# EasyEDA Pro project yuntai参考PCB.epro

# Schematic Schematic1
Assembly Variant: Basic; Board Name: Board1; Create Date: 2026-07-20; Page Name: P1; Project Name: yuntai3.0; Schematic Name: Schematic1; Update Date: 2026-07-20; Company: 嘉立创EDA; Page Size: A4; Version: V1.0
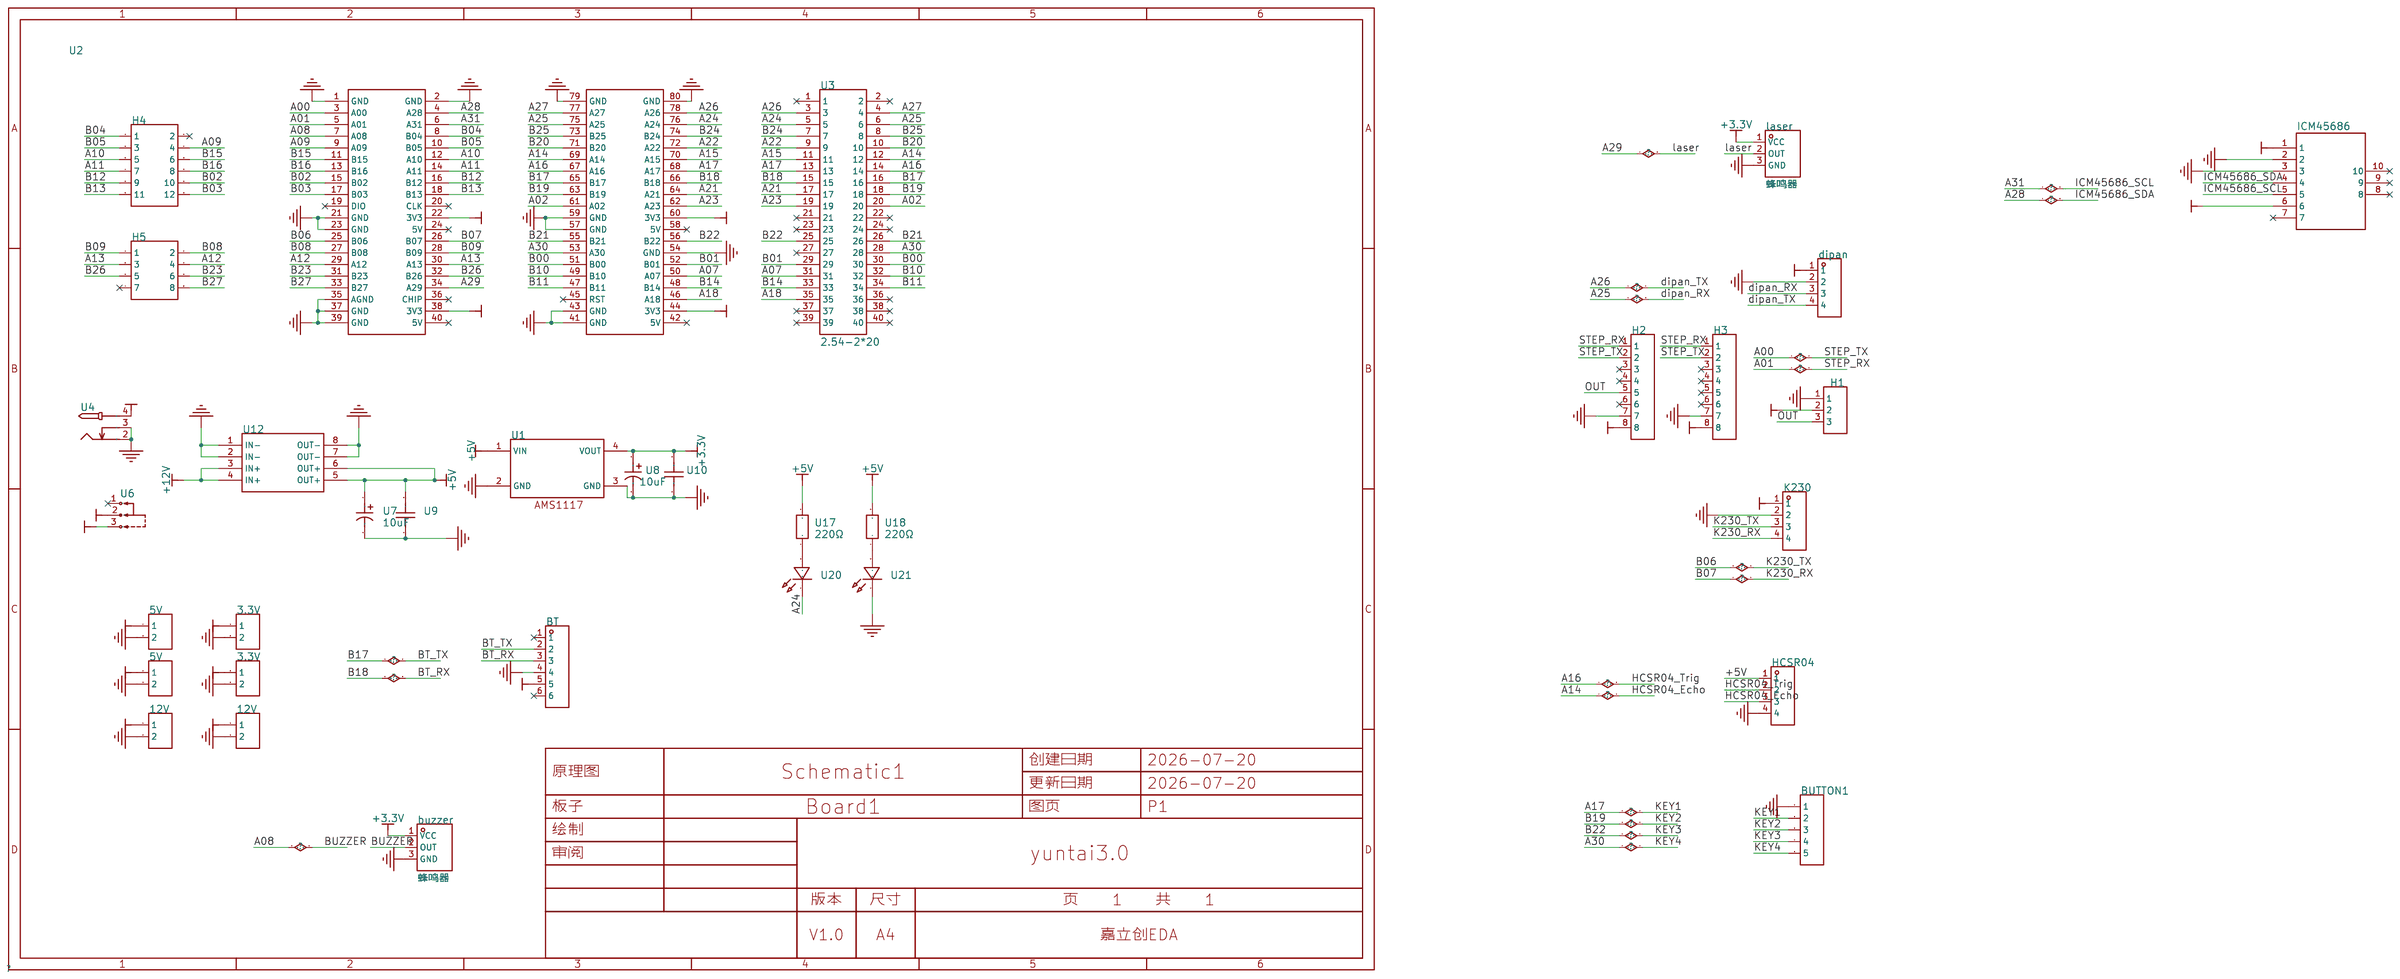
[diagram p0: schematic sheet]

## Parts
3.3V  -  [HDR-TH_2P-P2.54-V-F]
3.3V#2  -  [HDR-TH_2P-P2.54-V-F]
5V  -  [HDR-TH_2P-P2.54-V-F]
5V#2  -  [HDR-TH_2P-P2.54-V-F]
12V  -  [HDR-TH_2P-P2.54-V-F]
12V#2  -  [HDR-TH_2P-P2.54-V-F]
BT  -  [HDR-TH_6P-P2.54-V-F]
BUTTON1  -  [HDR-TH_5P-P2.54-V-F]
buzzer  蜂鸣器  [蜂鸣器]
dipan  -  [HDR-TH_4P-P2.54-V-F]
H1  -  [HDR-TH_3P-P2.54-V-F]
H2  -  [HDR-TH_8P-P2.54-V-F-1]
H3  -  [HDR-TH_8P-P2.54-V-F-1]
H4  -  [HDR-TH_12P-P2.54-V-M-R2-C6-S2.54]
H5  -  [HDR-TH_8P-P2.54-V-F-R2-C4-S2.54-1]
HCSR04  -  [HDR-TH_4P-P2.54-V-F]
ICM45686  -  [ICM45686]
K230  -  [HDR-TH_4P-P2.54-V-F]
laser  蜂鸣器  [蜂鸣器]
U1  -  [AMS1117模块]
U2  LCKFB-TMX-MSPM0G3507  [COMM-TH_LCKFB-TMX-MSPM0G3507]
U3  2.54-2*20  [HDR-TH_40P-P2.54-V-F-R2-C20-S2.54]
U4  DC005-2.5  [DC-IN-TH_DC005-2.5MM]
U6  SS12D10G5  [SW-TH_SHOU-HAN_SS12D10G4]
U7  10uF  [CAP-TH_BD5.0-P2.00-D0.5-FD-1]
U8  10uF  [CAP-TH_BD5.0-P2.00-D0.5-FD-1]
U9  -  [0.1uf陶瓷电容直插]
U10  -  [0.1uf陶瓷电容直插]
U12  -  [MP1584EN降压模块]
U17  220Ω  [RES-TH_BD2.7-L6.2-P10.20-D0.4]
U18  220Ω  [RES-TH_BD2.7-L6.2-P10.20-D0.4]
U20  LTL-307E  [LED-TH_BD3.0-P2.54-FD]
U21  LTL-307E  [LED-TH_BD3.0-P2.54-FD]

## Library data of the parts
3.3V 3.3V#2 5V 5V#2 12V 12V#2 = HDR-F_2.54_1x2P: Supplier Part: C49661; Supplier Footprint: 插件
BT = HDR-F_2.54_1x6P: Supplier Part: C40877; Supplier Footprint: 插件
BUTTON1 = HDR-F_2.54_1x5P: Supplier Part: C50950; Supplier Footprint: 插件
buzzer laser = 蜂鸣器: Supplier Part: C9900010938; Datasheet: https://atta.szlcsc.comnull; Supplier: LCSC
dipan HCSR04 K230 = HDR-F_2.54_1x4P: Supplier Part: C2718488; Supplier Footprint: 插件
H1 = HDR-F_2.54_1x3P: Supplier Part: C541850; Supplier Footprint: 插件
H2 H3 = HDR-F_2.54_1x8P: Supplier Part: C27438; Supplier Footprint: 插件
H4 = HDR-F_2.54_2x6
H5 = HDR-F_2.54_2x4: Supplier Part: C92271; Supplier Footprint: 插件
ICM45686 = ICM45686
U1 = AMS1117模块: _: 3
U2 = LCKFB-TMX-MSPM0G3507: 该开发板板载德州仪器的微控制器核心,完美适配电赛指定TI芯片题目的要求。支持Keil、CCS和IAU等环境开发,搭配图形化代码生成工具,无需在意底层驱动,助力快速开发。硬件上带有多电源保护,防反接/防过流/受电压,和三路参考电压选择,降低电衰试错成本。80P引脚的引出方便扩展,提供完善的入门手册和模块移植案例。; LCSC Part Name: 5件套 立创·天猛星MSPM0G3507开发板; Supplier Part: C42378531; Manufacturer: 立创开发板; JLCPCB Part Class: Extended Part; Datasheet: https://item.szlcsc.com/datasheet/LCKFB-TMX-MSPM0G3507/44281600.html; Supplier: LCSC
U3 = 2.54-2*20: 插孔结构:2x20P;间距:2.54mm;行距:2.54mm;圆孔/方孔:方孔;安装类型:直插;排数:双排;总孔位数:40P;额定电流:2.5A;额定电压:-;插孔方向:顶部;塑高:8.5mm;工作温度范围:-40℃~+105℃;; LCSC Part Name: 间距:2.54mm 2x20P 直插; Supplier Part: C2977589; Manufacturer: ZHOURI(洲日); Supplier Footprint: 插件,P=2.54mm; JLCPCB Part Class: 扩展库; Datasheet: https://atta.szlcsc.com/upload/public/pdf/source/20220328/834E302BE3C038BBC5C70F5E02589B1E.pdf; Supplier: LCSC; Holes Structure: 2x20P; Pitch: 2.54mm; Row Spacing: 2.54mm; Circular Hole / Square Hole: 方孔; Mounting Type: 直插; Number of Rows: 双排; Number of Holes: 40P; Current Rating (Max): 2.5A; Holes Direction: 顶部; Insulation Height: 8.5mm; Operating Temperature Range: -40℃~+105℃
U4 = DC005-2.5: 连接器类型:DC电源插座;安装方式:弯插;触点内径:2.5mm;触点外径:6.3mm;额定电流:500mA;额定电压:30V;工作温度范围:-25℃~+70℃;; LCSC Part Name: DC电源插座 内径:2.5mm 外径:6.3mm; Supplier Part: C7507454; Manufacturer: SHOU HAN(首韩); Supplier Footprint: 插件; JLCPCB Part Class: 扩展库; Datasheet: https://atta.szlcsc.com/upload/public/pdf/source/20231013/7634FFE9E6B635EE77C0C008CDC877DB.pdf; Supplier: LCSC; Connector Type: DC电源插座; Mounting Style: 弯插; Inside Contact Diameter: 2.5mm; Outside Contact Diameter: 6.3mm; Current Rating (Max): 500mA; Voltage Rating (Max): 30V; Operating Temperature Range: -25℃~+70℃
U6 = SS12D10G5: 电路结构:单刀双掷;安装方式:直插;额定电流(DC):2A;额定电压(DC):125V;机械寿命:3千次;; LCSC Part Name: 两档立式插件 3脚拨动开关 柄长5.0mm; Supplier Part: C7431054; Manufacturer: SHOU HAN(首韩); Supplier Footprint: 插件; JLCPCB Part Class: 扩展库; Datasheet: https://atta.szlcsc.com/upload/public/pdf/source/20231130/7A3DB6A149BF0A1DCFFE64FFC07FE434.pdf; Supplier: LCSC; Circuit: 单刀双掷; Switch Length: 12.7mm; Switch Width: 6.7mm; Mounting Style: 直插; Current Rating (DC): 2A; Voltage Rating (DC): 125V; Mechanical Life: 3千次; Operating Temperature: -25℃~+70℃
U7 U8 = CV4R7MG511BP: 容值:4.7uF;精度:±20%;额定电压:50V;纹波电流:58mA@100kHz;等效串联电阻(ESR):2.5Ω@100kHz;; LCSC Part Name: 4.7uF ±20% 50V; Supplier Part: C2844413; Manufacturer: TWBOR(伯鸿); Supplier Footprint: 插件,D5xL11mm; JLCPCB Part Class: 扩展库; Datasheet: https://atta.szlcsc.com/upload/public/pdf/source/20210727/C2844413_0C02A797581ED1BB0754F03B8FF69A80.pdf; Supplier: LCSC; Tolerance: ±20%; Voltage Rating: 50V; Ripple Current: 58mA@100kHz; Equivalent Series Resistance(ESR): 2.5Ω@100kHz; Pin Spacing: 2mm; Diameter: 5mm; Height - Seated (Max): 11mm; Lifetime: 5000hrs@105℃; Operating Temperature: -40℃~+105℃
U9 U10 = 0.1uf陶瓷电容直插
U12 = MP1584EN降压模块: _: 3
U17 U18 = MF1/4W-1K±1%-ST52: 电阻类型:金属膜电阻;阻值:1kΩ;精度:±1%;功率:250mW;温度系数:±100ppm/℃;; LCSC Part Name: 金属膜电阻 1kΩ ±1% 250mW; Supplier Part: C2903245; Manufacturer: VO(翔胜); Supplier Footprint: 插件,D2.7xL6.2mm; JLCPCB Part Class: 扩展库; Datasheet: https://atta.szlcsc.com/upload/public/pdf/source/20200609/C601728_5AA4C0C8E12E11069DA2C3356F29D1F2.pdf; Supplier: LCSC; Type: 金属膜电阻; Tolerance: ±1%; Overload Voltage (Max): 250V; Power(Watts): 250mW; Temperature Coefficient: ±100ppm/℃; Operating Temperature Range: -55℃~+155℃
U20 U21 = LTL-307E: 发光颜色:红色;正向电压(VF):2V;正向电流:20mA;主波长:623nm;透镜颜色:红色透镜;发光强度:19mcd;发光角度:50°;; LCSC Part Name: 直插F5红光LED; Supplier Part: C575489; Manufacturer: LITEON(光宝); Supplier Footprint: 插件; JLCPCB Part Class: 扩展库; Supplier: LCSC; Emitted Color: 红色; Forward Voltage (VF): 2V; Forward Current: 20mA; Dominant Wavelength: 623nm; Peak Wavelength: 635nm; Lens Color: 红色透镜; Luminous Intensity: 19mcd; Viewing Angle: 50°

## Nets
+3.3V: 3.3V.1 3.3V#2.1 buzzer.1(VCC) ICM45686.1 ICM45686.6 laser.1(VCC) U1.4(VOUT) U2.22(3V3) U2.38(3V3) U2.44(3V3) U2.60(3V3) U8.1 U10.2
+5V: 5V.1 5V#2.1 BT.5 dipan.1 H1.2 HCSR04.1 K230.1 U1.1(VIN) U7.1 U9.2 U12.5(OUT+) U12.6(OUT+) U17.2 U18.2
+12V: 12V.1 12V#2.1 H2.8 H3.8 U6.3 U12.3(IN+) U12.4(IN+)
GND: 3.3V.2 3.3V#2.2 5V.2 5V#2.2 12V.2 12V#2.2 BT.4 BUTTON1.1 buzzer.3(GND) dipan.2 H1.1 H2.7 H3.7 HCSR04.4 ICM45686.2 ICM45686.3 K230.2 laser.3(GND) U1.2(GND) U1.3(GND) U2.1(GND) U2.2(GND) U2.21(GND) U2.23(GND) U2.35(AGND) U2.37(GND) U2.39(GND) U2.41(GND) U2.43(GND) U2.54(GND) U2.57(GND) U2.59(GND) U2.79(GND) U2.80(GND) U4.2 U4.3 U7.2 U8.2 U9.1 U10.1 U12.1(IN-) U12.2(IN-) U12.7(OUT-) U12.8(OUT-) U21.1(C)
VCC: U4.4 U6.2
A00: H2.2 H3.2 U2.3(A00)
A01: H2.1 H3.1 U2.5(A01)
A02: U2.61(A02) U3.20
A07: U2.50(A07) U3.31
A08: buzzer.2(OUT) U2.7(A08)
A09: H4.4 U2.9(A09)
A10: H4.5 U2.12(A10)
A11: H4.7 U2.14(A11)
A12: H5.4 U2.29(A12)
A13: H5.3 U2.30(A13)
A14: HCSR04.3 U2.69(A14) U3.12
A15: U2.70(A15) U3.11
A16: HCSR04.2 U2.67(A16) U3.14
A17: BUTTON1.2 U2.68(A17) U3.13
A18: U2.46(A18) U3.35
A21: U2.64(A21) U3.17
A22: U2.72(A22) U3.9
A23: U2.62(A23) U3.19
A24: U2.76(A24) U3.5 U20.1(C)
A25: dipan.3 U2.75(A25) U3.6
A26: dipan.4 U2.78(A26) U3.3
A27: U2.77(A27) U3.4
A28: ICM45686.4 U2.4(A28)
A29: laser.2(OUT) U2.34(A29)
A30: BUTTON1.5 U2.53(A30) U3.28
A31: ICM45686.5 U2.6(A31)
B00: U2.51(B00) U3.30
B01: U2.52(B01) U3.29
B02: H4.10 U2.15(B02)
B03: H4.12 U2.17(B03)
B04: H4.1 U2.8(B04)
B05: H4.3 U2.10(B05)
B06: K230.3 U2.25(B06)
B07: K230.4 U2.26(B07)
B08: H5.2 U2.27(B08)
B09: H5.1 U2.28(B09)
B10: U2.49(B10) U3.32
B11: U2.47(B11) U3.34
B12: H4.9 U2.16(B12)
B13: H4.11 U2.18(B13)
B14: U2.48(B14) U3.33
B15: H4.6 U2.11(B15)
B16: H4.8 U2.13(B16)
B17: BT.2 U2.65(B17) U3.16
B18: BT.3 U2.66(B18) U3.15
B19: BUTTON1.3 U2.63(B19) U3.18
B20: U2.71(B20) U3.10
B21: U2.55(B21) U3.26
B22: BUTTON1.4 U2.56(B22) U3.25
B23: H5.6 U2.31(B23)
B24: U2.74(B24) U3.7
B25: U2.73(B25) U3.8
B26: H5.5 U2.32(B26)
B27: H5.8 U2.33(B27)
OUT: H1.3 H2.5
$1N55: U18.1 U21.2(A)
$1N66: U17.1 U20.2(A)

Not connected (* = marked no-connect by the designer): BT 1* 6*; H2 3* 4* 6*; H3 3* 4* 5* 6*; H4 2*; H5 7*; ICM45686 7* 8* 9* 10*; U2 19(DIO)* 20(CLK)* 24(5V)* 36(CHIP)* 40(5V)* 42(5V)* 45(RST)* 58(5V)*; U3 1* 2* 21* 22* 23* 24* 27* 36* 37* 38* 39* 40*; U6 1*

# Board PCB1
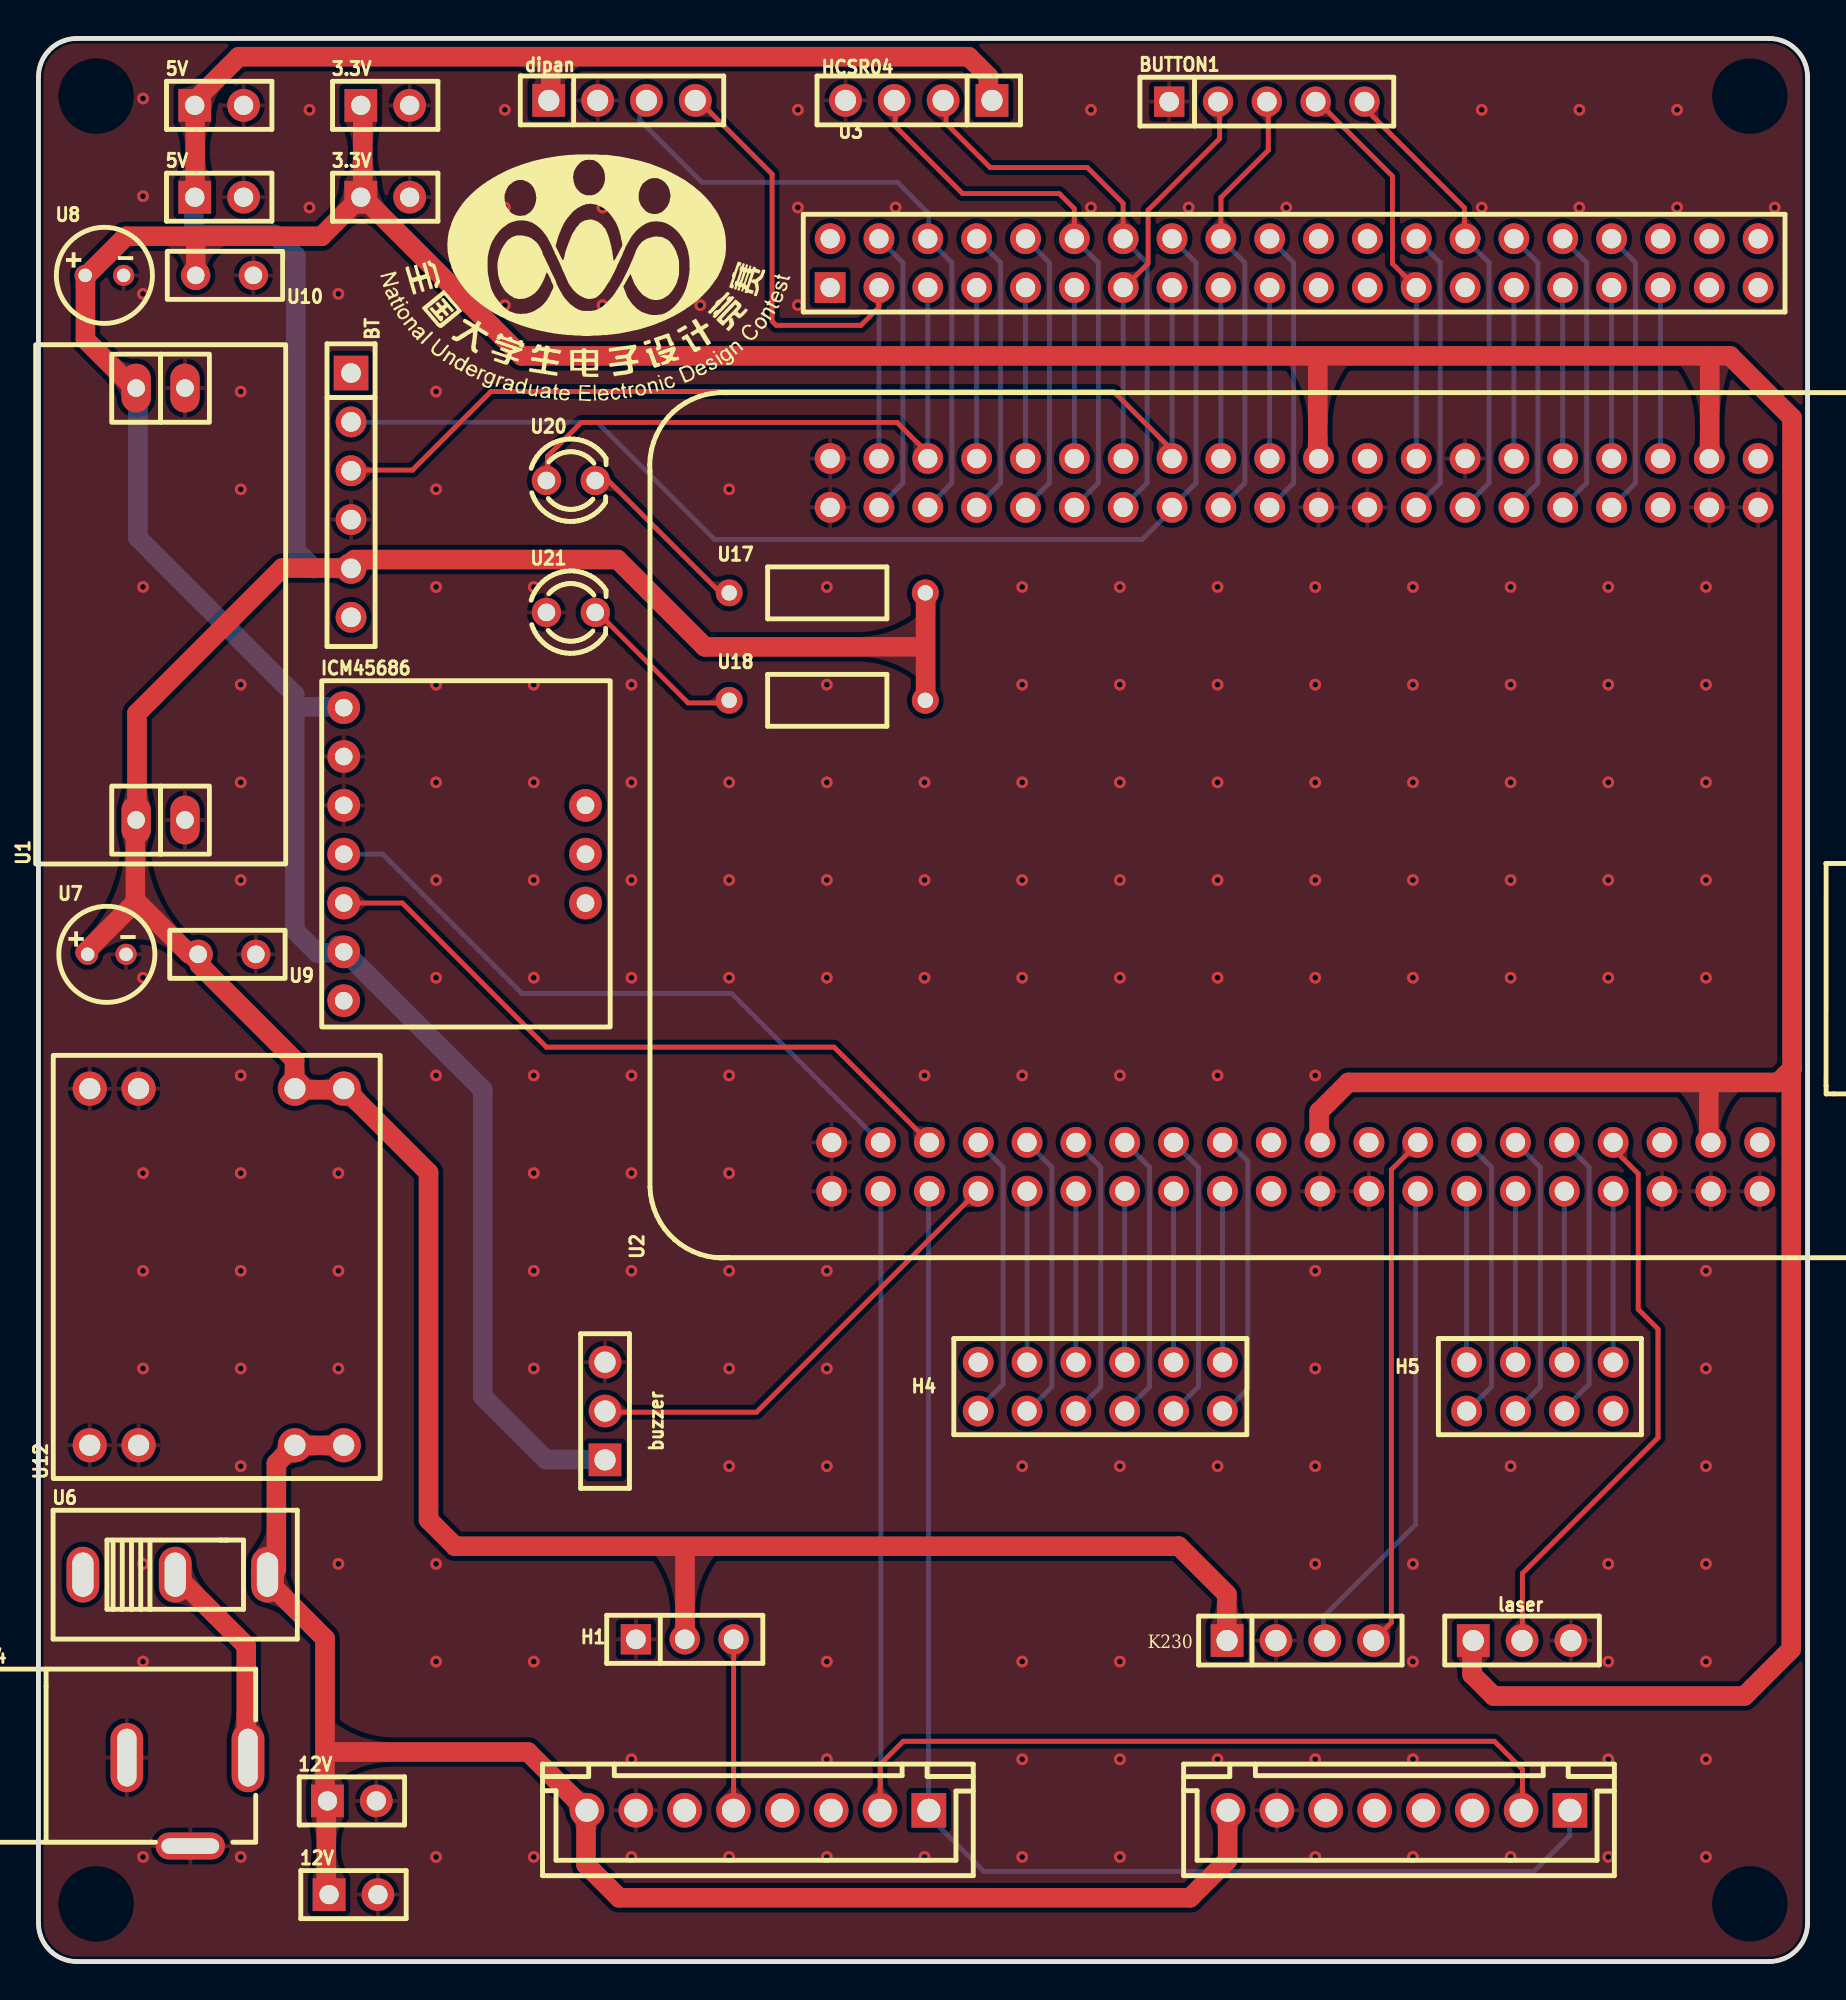
[diagram p1: board, top side]
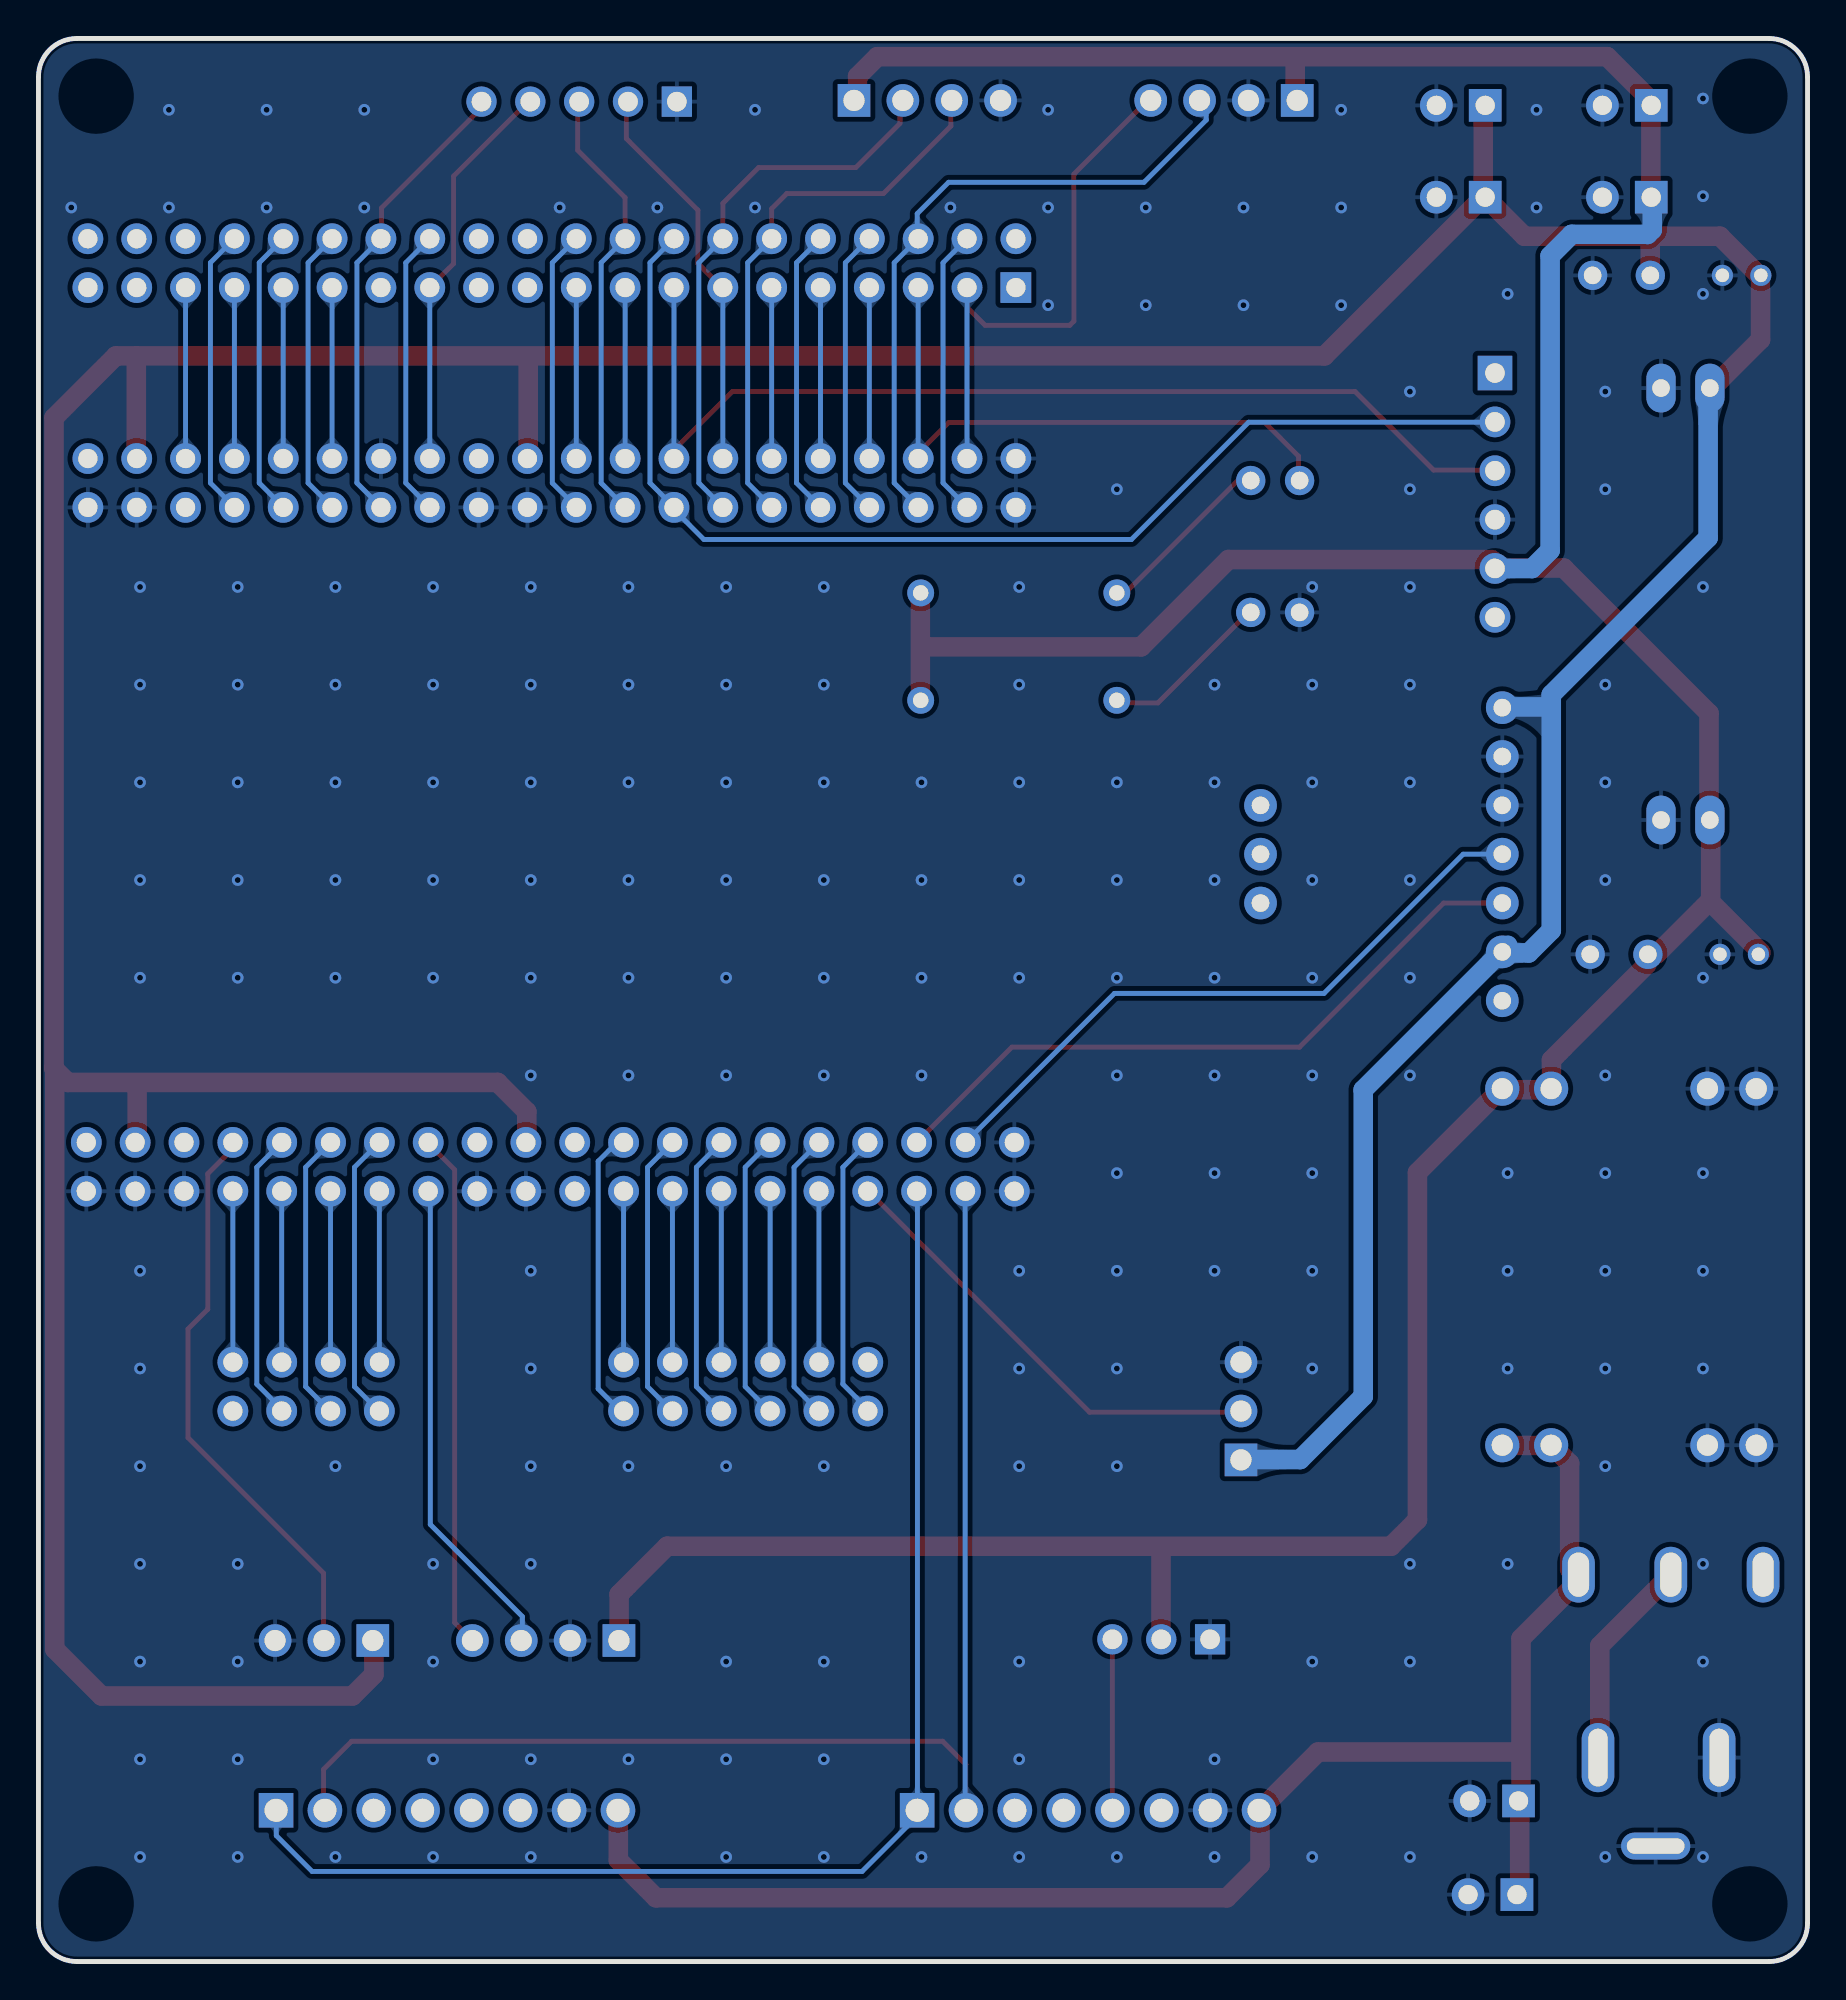
[diagram p2: board, bottom side, seen from below]

Outline 92 x 100 mm; copper layers: Top Layer, Bottom Layer. Coordinates in mm from the lower left corner of the outline.
Outline path: 0,98 0,2 arc(0.59,0.59) 2,0 90,0 arc(91.41,0.59) 92,2 92,98 arc(91.41,99.41) 90,100 2,100 arc(0.59,99.41) 0,98
Stack: Top Layer 0.035mm / Dielectric1 1.51mm FR4 er 4.5 / Bottom Layer 0.035mm

## Design rules (mm)
spacing copperThickness1oz (default): track to track 0.102, other pairs 0.152 to 0.3
spacing copperThickness2oz: track to track 0.203, other pairs 0.152 to 0.3
track width copperThickness1oz (default): min 0.127, default 0.254, max 2.54
track width copperThickness2oz: min 0.203, default 0.254, max 2.54
differential pair differentialPair (default): width min 0.127, default 0.254, max 2.54; gap min 0.152, default 0.152
net GND uses copperRegion

## Placement (name value [footprint] x y rotation side)
3.3V  -  [HDR-TH_2P-P2.54-V-F]  18.03 96.52 0 top
3.3V#2  -  [HDR-TH_2P-P2.54-V-F]  18.03 91.75 0 top
5V  -  [HDR-TH_2P-P2.54-V-F]  9.4 96.52 0 top
5V#2  -  [HDR-TH_2P-P2.54-V-F]  9.4 91.75 0 top
12V  -  [HDR-TH_2P-P2.54-V-F]  16.3 8.35 0 top
12V#2  -  [HDR-TH_2P-P2.54-V-F]  16.38 3.48 0 top
BT  -  [HDR-TH_6P-P2.54-V-F]  16.26 76.25 270 top
BUTTON1  -  [HDR-TH_5P-P2.54-V-F]  63.88 96.72 0 top
buzzer  -  [蜂鸣器]  29.46 28.63 90 top
dipan  -  [HDR-TH_4P-P2.54-V-F]  30.35 96.78 0 top
H1  -  [HDR-TH_3P-P2.54-V-F]  33.61 16.75 0 top
H2  -  [HDR-TH_8P-P2.54-V-F-1]  37.41 7.87 180 top
H3  -  [HDR-TH_8P-P2.54-V-F-1]  70.75 7.87 180 top
H4  -  [HDR-TH_12P-P2.54-V-M-R2-C6-S2.54]  55.22 29.9 0 top
H5  -  [HDR-TH_8P-P2.54-V-F-R2-C4-S2.54-1]  78.08 29.9 0 top
HCSR04  -  [HDR-TH_4P-P2.54-V-F]  45.78 96.78 180 top
ICM45686  -  [ICM45686]  54.23 42.22 0 top
K230  -  [HDR-TH_4P-P2.54-V-F]  65.62 16.69 0 top
laser  -  [蜂鸣器]  77.15 16.69 0 top
U1  -  [AMS1117模块]  6.35 70.03 90 top
U2  LCKFB-TMX-MSPM0G3507  [COMM-TH_LCKFB-TMX-MSPM0G3507]  65.34 59.11 90 top
U3  2.54-2*20  [HDR-TH_40P-P2.54-V-F-R2-C20-S2.54]  65.3 88.44 0 top
U4  DC005-2.5  [DC-IN-TH_DC005-2.5MM]  7.75 8.31 0 top
U6  SS12D10G5  [SW-TH_SHOU-HAN_SS12D10G4]  7.11 20.12 0 top
U7  10uF  [CAP-TH_BD5.0-P2.00-D0.5-FD-1]  3.56 52.38 0 top
U8  10uF  [CAP-TH_BD5.0-P2.00-D0.5-FD-1]  3.43 87.68 0 top
U9  -  [0.1uf陶瓷电容直插]  10.29 52.25 180 top
U10  -  [0.1uf陶瓷电容直插]  10.16 87.55 180 top
U12  -  [MP1584EN降压模块]  9.27 36.12 90 top
U17  220Ω  [RES-TH_BD2.7-L6.2-P10.20-D0.4]  41.02 71.17 0 top
U18  220Ω  [RES-TH_BD2.7-L6.2-P10.20-D0.4]  41.02 65.58 0 top
U20  LTL-307E  [LED-TH_BD3.0-P2.54-FD]  27.69 77.01 0 top
U21  LTL-307E  [LED-TH_BD3.0-P2.54-FD]  27.69 70.16 0 top

## Footprints (pads in the part's own frame, mm; a bottom-side part is the same pattern mirrored in y, then rotated)
0.1uf陶瓷电容直插
  round 1.524 hole 0.914: 1(-1.016,-0.127) 2(1.984,-0.127)
AMS1117模块
  oval 2.54x1.524 hole 0.914: 1(-10.668,1.27) 2(-10.668,-1.27) 3(11.792,-1.27) 4(11.792,1.27)
CAP-TH_BD5.0-P2.00-D0.5-FD-1
  round 1.1 hole 0.7: 1(-1,0) 2(1,0)
COMM-TH_LCKFB-TMX-MSPM0G3507
  round 1.6 hole 1: 1(-19.05,24.09) 2(-16.51,24.09) 3(-19.05,21.549) 4(-16.51,21.549) 5(-19.05,19.009) 6(-16.51,19.009) 7(-19.05,16.47) 8(-16.51,16.47) 9(-19.05,13.93) 10(-16.51,13.93) 11(-19.05,11.389) 12(-16.51,11.389) 13(-19.05,8.85) 14(-16.51,8.85) 15(-19.05,6.309) 16(-16.51,6.309) 17(-19.05,3.769) 18(-16.51,3.769) 19(-19.05,1.23) 20(-16.51,1.23) 21(-19.05,-1.31) 22(-16.51,-1.31) 23(-19.05,-3.85) 24(-16.51,-3.85) 25(-19.05,-6.391) 26(-16.51,-6.391) 27(-19.05,-8.931) 28(-16.51,-8.931) 29(-19.05,-11.47) 30(-16.51,-11.47) 31(-19.05,-14.011) 32(-16.51,-14.011) 33(-19.05,-16.55) 34(-16.51,-16.55) 35(-19.05,-19.09) 36(-16.51,-19.09) 37(-19.05,-21.631) 38(-16.51,-21.631) 39(-19.05,-24.171) 40(-16.51,-24.171) 41(16.51,-24.09) 42(19.05,-24.09) 43(16.51,-21.549) 44(19.05,-21.549) 45(16.51,-19.009) 46(19.05,-19.009) 47(16.51,-16.47) 48(19.05,-16.47) 49(16.51,-13.93) 50(19.05,-13.93) 51(16.51,-11.389) 52(19.05,-11.389) 53(16.51,-8.85) 54(19.05,-8.85) 55(16.51,-6.309) 56(19.05,-6.309) 57(16.51,-3.769) 58(19.05,-3.769) 59(16.51,-1.23) 60(19.05,-1.23) 61(16.51,1.31) 62(19.05,1.31) 63(16.51,3.85) 64(19.05,3.85) 65(16.51,6.391) 66(19.05,6.391) 67(16.51,8.931) 68(19.05,8.931) 69(16.51,11.47) 70(19.05,11.47) 71(16.51,14.011) 72(19.05,14.011) 73(16.51,16.55) 74(19.05,16.55) 75(16.51,19.09) 76(19.05,19.09) 77(16.51,21.631) 78(19.05,21.631) 79(16.51,24.171) 80(19.05,24.171)
DC-IN-TH_DC005-2.5MM
  oval 3.6x1.4 hole 3x0.8: 2(0.15,-2.3)
  oval 1.7x3.6 hole 1x3: 3(-3.15,2.3) 4(3.15,2.3)
HDR-TH_2P-P2.54-V-F
  rect 1.7x1.7 hole 1: 1(-1.27,0)
  round 1.7 hole 1: 2(1.27,0)
HDR-TH_3P-P2.54-V-F
  rect 1.575x1.575 hole 1.02: 1(-2.54,0)
  round 1.575 hole 1.02: 2(0,0) 3(2.54,0)
HDR-TH_4P-P2.54-V-F
  rect 1.7x1.7 hole 1.1: 1(-3.81,0)
  round 1.7 hole 1.1: 2(-1.27,0) 3(1.27,0) 4(3.81,0)
HDR-TH_5P-P2.54-V-F
  rect 1.575x1.575 hole 1.02: 1(-5.08,0)
  round 1.575 hole 1.02: 2(-2.54,0) 3(0,0) 4(2.54,0) 5(5.08,0)
HDR-TH_6P-P2.54-V-F
  rect 1.8x1.8 hole 1.02: 1(-6.35,0)
  round 1.6 hole 1.02: 2(-3.81,0) 3(-1.27,0) 4(1.27,0) 5(3.81,0) 6(6.35,0)
HDR-TH_8P-P2.54-V-F-1
  rect 1.8x1.8 hole 1.2: 1(-8.89,0)
  round 1.8 hole 1.2: 2(-6.35,0) 3(-3.81,0) 4(-1.27,0) 5(1.27,0) 6(3.81,0) 7(6.35,0) 8(8.89,0)
HDR-TH_8P-P2.54-V-F-R2-C4-S2.54-1
  round 1.6 hole 1: 1(-3.81,-1.27) 2(-3.81,1.27) 3(-1.27,-1.27) 4(-1.27,1.27) 5(1.27,-1.27) 6(1.27,1.27) 7(3.81,-1.27) 8(3.81,1.27)
HDR-TH_12P-P2.54-V-M-R2-C6-S2.54
  round 1.6 hole 1: 1(-6.35,-1.27) 2(-6.35,1.27) 3(-3.81,-1.27) 4(-3.81,1.27) 5(-1.27,-1.27) 6(-1.27,1.27) 7(1.27,-1.27) 8(1.27,1.27) 9(3.81,-1.27) 10(3.81,1.27) 11(6.35,-1.27) 12(6.35,1.27)
HDR-TH_40P-P2.54-V-F-R2-C20-S2.54
  rect 1.6x1.6 hole 1: 1(-24.13,-1.397)
  round 1.6 hole 1: 2(-24.13,1.143) 3(-21.59,-1.397) 4(-21.59,1.143) 5(-19.05,-1.397) 6(-19.05,1.143) 7(-16.51,-1.397) 8(-16.51,1.143) 9(-13.97,-1.397) 10(-13.97,1.143) 11(-11.43,-1.397) 12(-11.43,1.143) 13(-8.89,-1.397) 14(-8.89,1.143) 15(-6.35,-1.397) 16(-6.35,1.143) 17(-3.81,-1.397) 18(-3.81,1.143) 19(-1.27,-1.397) 20(-1.27,1.143) 21(1.27,-1.397) 22(1.27,1.143) 23(3.81,-1.397) 24(3.81,1.143) 25(6.35,-1.397) 26(6.35,1.143) 27(8.89,-1.397) 28(8.89,1.143) 29(11.43,-1.397) 30(11.43,1.143) 31(13.97,-1.397) 32(13.97,1.143) 33(16.51,-1.397) 34(16.51,1.143) 35(19.05,-1.397) 36(19.05,1.143) 37(21.59,-1.397) 38(21.59,1.143) 39(24.13,-1.397) 40(24.13,1.143)
ICM45686
  round 1.7 hole 0.914: 1(-38.354,22.987) 2(-38.354,20.447) 3(-38.354,17.907) 4(-38.354,15.367) 5(-38.354,12.827) 6(-38.354,10.287) 7(-38.354,7.747) 8(-25.781,17.907) 9(-25.781,15.367) 10(-25.781,12.827)
LED-TH_BD3.0-P2.54-FD
  round 1.524 hole 0.914: 1(-1.27,0) 2(1.27,0)
MP1584EN降压模块
  round 1.778 hole 1.1: 1(-9.271,6.604) 2(-9.271,4.064) 3(-9.271,-4.064) 4(-9.271,-6.604) 5(9.271,-6.604) 6(9.271,-4.064) 7(9.271,4.064) 8(9.271,6.604)
RES-TH_BD2.7-L6.2-P10.20-D0.4
  round 1.4 hole 0.8: 1(-5.1,0) 2(5.1,0)
SW-TH_SHOU-HAN_SS12D10G4
  oval 1.7x2.9 hole 1.1x2.3: 1(-4.8,0) 2(0,0) 3(4.8,0)
蜂鸣器
  rect 1.7x1.7 hole 1.1: 1(-2.54,0)
  round 1.7 hole 1.1: 2(0,0) 3(2.54,0)

## Nets
As in the schematic.

Pads without a net: BT 1 6; H2 3 4 6; H3 3 4 5 6; H4 2; H5 7; ICM45686 7 8 9 10; U2 19 20 24 36 40 42 45 58; U3 1 2 21 22 23 24 27 36 37 38 39 40; U6 1

## Via types
v1: diameter 0.61, hole 0.305, Top Layer to Bottom Layer, 185 vias

## Routing (per net, layer and track width the routed paths; a pad name or vN(x,y) marks a point on that pad's centre or on a via; arc(x,y) is an arc through that point)
+3.3V: length 303.7
  Top Layer w1.016: 16.86,92.09 16.86,96.16 16.77,96.25 ; 74.55,16.58 74.55,14.93 75.67,13.81 88.72,13.81 91.15,16.24 91.15,46.39 ; 91.19,46.47 91.15,46.39 ; 91.19,46.47 91.19,46.43 91.15,46.39 ; 91.19,46.47 91.19,80.27 87.97,83.49 25.12,83.49 16.53,92.09 ; 91.15,46.39 90.47,45.71 68.12,45.71 66.6,44.2 66.6,42.37 ; 66.53,78.34 66.53,83.38 66.51,83.4 ; 86.94,45.52 86.87,45.45 86.87,42.64 ; 5.07,81.72 2.44,84.34 2.44,87.69 ; 16.66,91.65 14.72,89.71 4.55,89.71 2.61,87.77 ; 8.18,87.64 8.18,89.41 8.17,89.42 ; 86.9,83.49 86.91,83.47 86.91,78.1
  Bottom Layer w1.016: 5.17,81.57 5.17,74.03 13.33,65.88 13.33,53.62 14.5,52.45 15.77,52.45 ; 29.38,26.1 26.39,26.1 23.11,29.39 23.11,45.33 15.59,52.84 ; 15.91,65.24 13.5,65.24 13.43,65.17
+5V: length 229.9
  Top Layer w1.016: 8.15,91.91 8.15,96.36 8.3,96.51 ; 16.26,72.34 16.14,72.46 12.67,72.46 5.12,64.91 5.12,59.34 ; 26.57,98.83 26.64,98.76 26.64,96.82 ; 8.28,52.41 7.82,52.41 5.1,55.13 ; 46.14,70.71 46.14,65.49 ; 5.07,59.15 5.04,59.12 5.04,55.09 2.42,52.47 ; 15.9,45.42 20.29,41.03 20.29,22.97 21.66,21.6 59.31,21.6 61.8,19.1 61.8,16.56 ; 16.42,72.9 30.11,72.9 34.65,68.37 45.78,68.37 ; 49.4,97.2 49.4,98.03 48.38,99.05 10.42,99.05 8.08,96.72 ; 8.35,51.85 13.32,46.88 13.32,45.34 15.55,45.34 ; 33.62,16.79 33.62,21.48 33.65,21.51
  Bottom Layer w1.016: 16.17,72.45 16.16,72.44 14.33,72.44 13.39,73.38 13.39,88.69 12.27,89.81 8.32,89.81 8.08,90.05 8.08,91.56
+12V: length 81.9
  Top Layer w1.016: 14.94,8 14.97,7.97 14.97,3.69 ; 14.9,8.47 14.9,16.8 11.56,20.14 ; 28.47,7.61 28.47,5.04 30.19,3.32 59.89,3.32 61.84,5.27 61.84,7.86 ; 15.91,26.84 13.3,26.84 12.37,25.91 12.37,20.37 ; 14.92,10.9 25.46,10.9 28.61,7.75
GND:
  vias: v1(5.44,96.88) v1(5.44,91.8) v1(5.44,86.72) v1(5.44,71.48) v1(5.44,51.16) v1(5.44,41) v1(5.44,35.92) v1(5.44,30.84) v1(5.44,20.68) v1(5.44,15.6) v1(5.44,5.44) v1(10.52,81.64) v1(10.52,76.56) v1(10.52,66.4) v1(10.52,61.32) v1(10.52,56.24) v1(10.52,46.08) v1(10.52,41) v1(10.52,35.92) v1(10.52,30.84) v1(10.52,25.76) v1(10.52,5.44) v1(14.09,96.29) v1(14.09,91.21) v1(15.6,86.72) v1(15.6,41) v1(15.6,35.92) v1(15.6,30.84) v1(15.6,20.68) v1(20.68,81.64) v1(20.68,76.56) v1(20.68,71.48) v1(20.68,66.4) v1(20.68,61.32) v1(20.68,56.24) v1(20.68,51.16) v1(20.68,46.08) v1(20.68,20.68) v1(20.68,15.6) v1(20.68,5.44) v1(24.25,96.29) v1(24.25,91.21) v1(24.25,86.13) v1(25.76,71.48) v1(25.76,66.4) v1(25.76,61.32) v1(25.76,56.24) v1(25.76,51.16) v1(25.76,46.08) v1(25.76,41) v1(25.76,35.92) v1(25.76,30.84) v1(25.76,15.6) v1(25.76,5.44) v1(29.34,91.21) v1(29.34,86.13) v1(30.84,66.4) v1(30.84,61.32) v1(30.84,56.24) v1(30.84,51.16) v1(30.84,46.08) v1(30.84,41) v1(30.84,35.92) v1(30.84,10.52) v1(30.84,5.44) v1(34.41,91.21) v1(34.41,86.13) v1(35.92,76.56) v1(35.92,61.32) v1(35.92,56.24) v1(35.92,51.16) v1(35.92,46.08) v1(35.92,41) v1(35.92,35.92) v1(35.92,30.84) v1(35.92,25.76) v1(35.92,5.44) v1(39.5,96.29) v1(39.5,91.21) v1(39.5,86.13) v1(41,71.48) v1(41,66.4) v1(41,61.32) v1(41,56.24) v1(41,51.16) v1(41,35.92) v1(41,30.84) v1(41,25.76) v1(41,15.6) v1(41,10.52) v1(41,5.44) v1(44.57,91.21) v1(46.08,61.32) v1(46.08,56.24) v1(46.08,51.16) v1(46.08,46.08) v1(46.08,5.44) v1(51.16,71.48) v1(51.16,66.4) v1(51.16,61.32) v1(51.16,56.24) v1(51.16,51.16) v1(51.16,46.08) v1(51.16,25.76) v1(51.16,15.6) v1(51.16,10.52) v1(51.16,5.44) v1(54.74,96.29) v1(54.74,91.21) v1(56.24,71.48) v1(56.24,66.4) v1(56.24,61.32) v1(56.24,56.24) v1(56.24,51.16) v1(56.24,46.08) v1(56.24,25.76) v1(56.24,15.6) v1(56.24,10.52) v1(56.24,5.44) v1(59.81,91.21) v1(61.32,71.48) v1(61.32,66.4) v1(61.32,61.32) v1(61.32,56.24) v1(61.32,51.16) v1(61.32,46.08) v1(61.32,25.76) v1(61.32,10.52) v1(64.9,91.21) v1(66.4,71.48) v1(66.4,66.4) v1(66.4,61.32) v1(66.4,56.24) v1(66.4,51.16) v1(66.4,46.08) v1(66.4,35.92) v1(66.4,30.84) v1(66.4,25.76) v1(66.4,20.68) v1(66.4,10.52) v1(66.4,5.44) v1(71.48,71.48) v1(71.48,66.4) v1(71.48,61.32) v1(71.48,56.24) v1(71.48,51.16) v1(71.48,20.68) v1(71.48,15.6) v1(71.48,10.52) v1(71.48,5.44) v1(75.06,96.29) v1(75.06,91.21) v1(76.56,71.48) v1(76.56,66.4) v1(76.56,61.32) v1(76.56,56.24) v1(76.56,51.16) v1(76.56,25.76) v1(76.56,5.44) v1(80.13,96.29) v1(80.13,91.21) v1(81.64,71.48) v1(81.64,66.4) v1(81.64,61.32) v1(81.64,56.24) v1(81.64,51.16) v1(81.64,20.68) v1(81.64,15.6) v1(81.64,10.52) v1(81.64,5.44) v1(85.22,96.29) v1(85.22,91.21) v1(86.72,71.48) v1(86.72,66.4) v1(86.72,61.32) v1(86.72,56.24) v1(86.72,51.16) v1(86.72,35.92) v1(86.72,30.84) v1(86.72,25.76) v1(86.72,20.68) v1(86.72,15.6) v1(86.72,10.52) v1(86.72,5.44) v1(90.29,91.21)
VCC: length 10.8
  Top Layer w1.016: 10.8,10.89 10.8,16.42 7.05,20.18
A00: length 69.9
  Top Layer w0.254: 77.17,8.2 77.17,10 75.72,11.45 44.98,11.45 43.77,10.25 43.77,8.31
  Bottom Layer w0.254: 43.81,39.75 43.81,8.41 43.58,8.18
A01: length 69
  Bottom Layer w0.254: 46.21,40 46.29,39.92 46.29,7.72 ; 79.63,7.85 79.63,6.55 77.77,4.69 49.17,4.69 46.26,7.59
A02: length 15
  Bottom Layer w0.254: U2.61 64.03,75.64 65.28,76.89 65.28,88.34 U3.20
A07: length 8.9
  Bottom Layer w0.254: U3.31 U2.50
A08: length 23.6
  Top Layer w0.254: 29.43,28.57 37.34,28.57 48.45,39.67
A09: length 8.9
  Bottom Layer w0.254: U2.9 H4.4
A10: length 15.1
  Bottom Layer w0.254: H4.5 53.97,28.63 55.25,29.9 55.25,41.3 U2.12
A11: length 15.1
  Bottom Layer w0.254: H4.7 56.51,28.63 57.78,29.9 57.78,41.3 U2.14
A12: length 8.9
  Bottom Layer w0.254: U2.29 76.81,31.17
A13: length 15.1
  Bottom Layer w0.254: 76.81,28.63 76.84,28.63 78.1,29.9 78.1,41.3 U2.30
A14: length 28.8
  Top Layer w0.254: 53.87,89.67 53.87,91.15 53.08,91.93 48.06,91.93 44.55,95.44 44.55,96.71
  Bottom Layer w0.254: U3.12 55.12,88.34 55.12,76.89 53.87,75.64 U2.69
A15: length 8.9
  Bottom Layer w0.254: U3.11 U2.70
A16: length 28.6
  Top Layer w0.254: 47.2,96.43 47.2,95.59 49.5,93.29 54.55,93.29 56.41,91.43 56.41,89.69 56.48,89.62
  Bottom Layer w0.254: U2.67 56.41,75.64 57.66,76.89 57.66,88.34 U3.14
A17: length 20.7
  Top Layer w0.254: 56.4,87 57.71,88.3 57.71,91.07 61.43,94.79 61.43,96.76
  Bottom Layer w0.254: U3.13 U2.68
A18: length 8.9
  Bottom Layer w0.254: U3.35 U2.46
A21: length 8.9
  Bottom Layer w0.254: U3.17 U2.64
A22: length 8.9
  Bottom Layer w0.254: U3.9 U2.72
A23: length 8.9
  Bottom Layer w0.254: U3.19 U2.62
A24: length 31.1
  Top Layer w0.254: 46.17,78.51 44.65,80.03 28.23,80.03 26.47,78.28 26.47,77.17
  Bottom Layer w0.254: U3.5 U2.76
A25: length 33.7
  Bottom Layer w0.254: U3.6 47.5,88.34 47.5,76.89 46.25,75.64 U2.75 ; 31.27,96.2 31.27,95.76 34.51,92.52 44.67,92.52 46.3,90.89 46.3,89.65
A26: length 28.8
  Top Layer w0.254: 34.27,96.83 38.15,92.95 38.15,85.3 38.37,85.08 42.77,85.08 43.69,86 43.69,86.77
  Bottom Layer w0.254: U3.3 U2.78
A27: length 15
  Bottom Layer w0.254: U2.77 43.71,75.64 44.96,76.89 44.96,88.34 U3.4
A28: length 34.1
  Bottom Layer w0.254: U2.4 36.04,50.34 25.15,50.34 17.91,57.58 ICM45686.4
A29: length 29.6
  Top Layer w0.254: 77.17,16.91 77.17,20.19 84.22,27.24 84.22,32.89 83.2,33.92 83.2,40.96 81.67,42.49
A30: length 24.2
  Top Layer w0.254: 68.78,96.57 74.16,91.19 74.16,89.64
  Bottom Layer w0.254: U2.53 74.19,75.64 75.44,76.89 75.44,88.34 U3.28
A31: length 35.6
  Top Layer w0.254: U2.6 41.38,47.55 26.42,47.55 18.92,55.04 ICM45686.5
B00: length 15
  Bottom Layer w0.254: U2.51 76.73,75.64 77.98,76.89 77.98,88.34 U3.30
B01: length 8.9
  Bottom Layer w0.254: U3.29 U2.52
B02: length 8.9
  Bottom Layer w0.254: U2.15 H4.10
B03: length 8.9
  Bottom Layer w0.254: U2.17 H4.12
B04: length 15
  Bottom Layer w0.254: U2.8 50.16,41.3 50.16,30.02 48.87,28.73 H4.1
B05: length 15.1
  Bottom Layer w0.254: H4.3 51.44,28.63 52.71,29.9 52.71,41.3 U2.10
B06: length 25.2
  Bottom Layer w0.254: 71.49,39.93 71.62,39.8 71.62,22.73 66.83,17.94 66.83,16.77
B07: length 26.7
  Top Layer w0.254: 71.7,42.52 70.36,41.17 70.36,17.62 69.47,16.73
B08: length 8.9
  Bottom Layer w0.254: U2.27 H5.2
B09: length 15.1
  Bottom Layer w0.254: H5.1 74.29,28.63 75.56,29.9 75.56,41.3 U2.28
B10: length 15
  Bottom Layer w0.254: U3.32 80.52,88.34 80.52,76.89 79.27,75.64 U2.49
B11: length 15
  Bottom Layer w0.254: U3.34 83.06,88.34 83.06,76.89 81.81,75.64 U2.47
B12: length 15.1
  Bottom Layer w0.254: U2.16 60.32,41.3 60.32,29.9 59.06,28.63 H4.9
B13: length 15.1
  Bottom Layer w0.254: 61.61,28.51 62.89,29.78 62.89,41.61 61.83,42.68
B14: length 8.9
  Bottom Layer w0.254: U3.33 U2.48
B15: length 8.9
  Bottom Layer w0.254: U2.11 H4.6
B16: length 8.9
  Bottom Layer w0.254: U2.13 H4.8
B17: length 60.9
  Bottom Layer w0.254: 58.99,75.54 57.39,73.95 35.16,73.95 29.06,80.04 16.28,80.04 ; 58.95,75.64 60.2,76.89 60.2,88.34 U3.16
B18: length 55.3
  Top Layer w0.254: 16.19,77.58 16.21,77.56 19.44,77.56 23.53,81.64 55.91,81.64 59.42,78.13
  Bottom Layer w0.254: U3.15 U2.66
B19: length 22.7
  Top Layer w0.254: 63.96,96.38 63.96,94.19 61.49,91.72 61.49,89.76 61.53,89.72
  Bottom Layer w0.254: U3.18 62.74,88.34 62.74,76.89 61.49,75.64 U2.63
B20: length 15
  Bottom Layer w0.254: U2.71 51.33,75.64 52.58,76.89 52.58,88.34 U3.10
B21: length 15
  Bottom Layer w0.254: U3.26 72.9,88.34 72.9,76.89 71.65,75.64 U2.55
B22: length 20.6
  Top Layer w0.254: 71.68,87.13 71.57,87.13 70.41,88.29 70.41,92.84 66.56,96.69
  Bottom Layer w0.254: U3.25 U2.56
B23: length 8.9
  Bottom Layer w0.254: U2.31 H5.6
B24: length 8.9
  Bottom Layer w0.254: U3.7 U2.74
B25: length 15
  Bottom Layer w0.254: U3.8 50.04,88.34 50.04,76.89 48.79,75.64 U2.73
B26: length 15
  Bottom Layer w0.254: U2.32 80.65,41.3 80.65,30.02 79.35,28.73 H5.5
B27: length 8.9
  Bottom Layer w0.254: U2.33 H5.8
OUT: length 8.9
  Top Layer w0.254: 36.15,16.65 36.15,7.88 36.22,7.82
$1N55: length 9.2
  Top Layer w0.254: 36.15,65.45 33.78,65.45 29.24,70 28.88,70
$1N66: length 8.9
  Top Layer w0.254: 35.49,71.15 29.64,77 29.02,77

## Copper pours and planes (outline as drawn; the poured copper is in the pictures)
GND on Top Layer: -3.15,103.44 96.19,103.44 96.19,-1.54 -3.15,-1.54
GND on Bottom Layer: -9.14,107.7 100.08,107.7 100.08,-9.14 -9.14,-9.14

Small or netless copper shapes (teardrops, artwork), in the pictures only: 88 on Top Layer, 114 on Bottom Layer
